# Altium schematic sheet Slave2.SchDoc
size A4; SheetNumber: 6; SheetTotal: 8
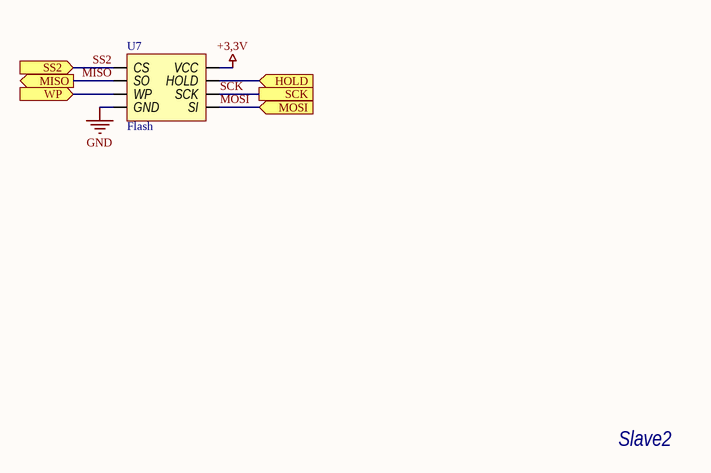
[diagram p0: Slave2.SchDoc]

## Parts
U7  Flash  [SOIC-8-0]

## Ports
HOLD (in), MISO (out), MOSI (in), SCK, SS2 (in), WP (in)

## Nets
+3,3V: U7.8(VCC)
GND: U7.4(GND)
HOLD: U7.7(HOLD) ; port HOLD
MISO: U7.2(SO) ; port MISO
MOSI: U7.5(SI) ; port MOSI
SCK: U7.6(SCK) ; port SCK
SS2: U7.1(CS) ; port SS2
WP: U7.3(WP) ; port WP

## Notes on the sheet
- Slave2

## Library data of the parts
U7 = AT25DF32A-SH-T: 32MBit Flash memore 100 MHz; Manufacturer: Adesto Technologies; ComponentLink1Description: Dayasheet; ComponentLink1URL: https://static.chipdip.ru/lib/314/DOC000314047.pdf; ComponentLink2Description: ChipDip; ComponentLink2URL: https://www.chipdip.ru/product/at25df321a-sh-t?from=suggest_product; Type: IC; Part Number: AT25DF32A-SH-T